# EAGLE design traffic_light (EAGLE 9.4.0)
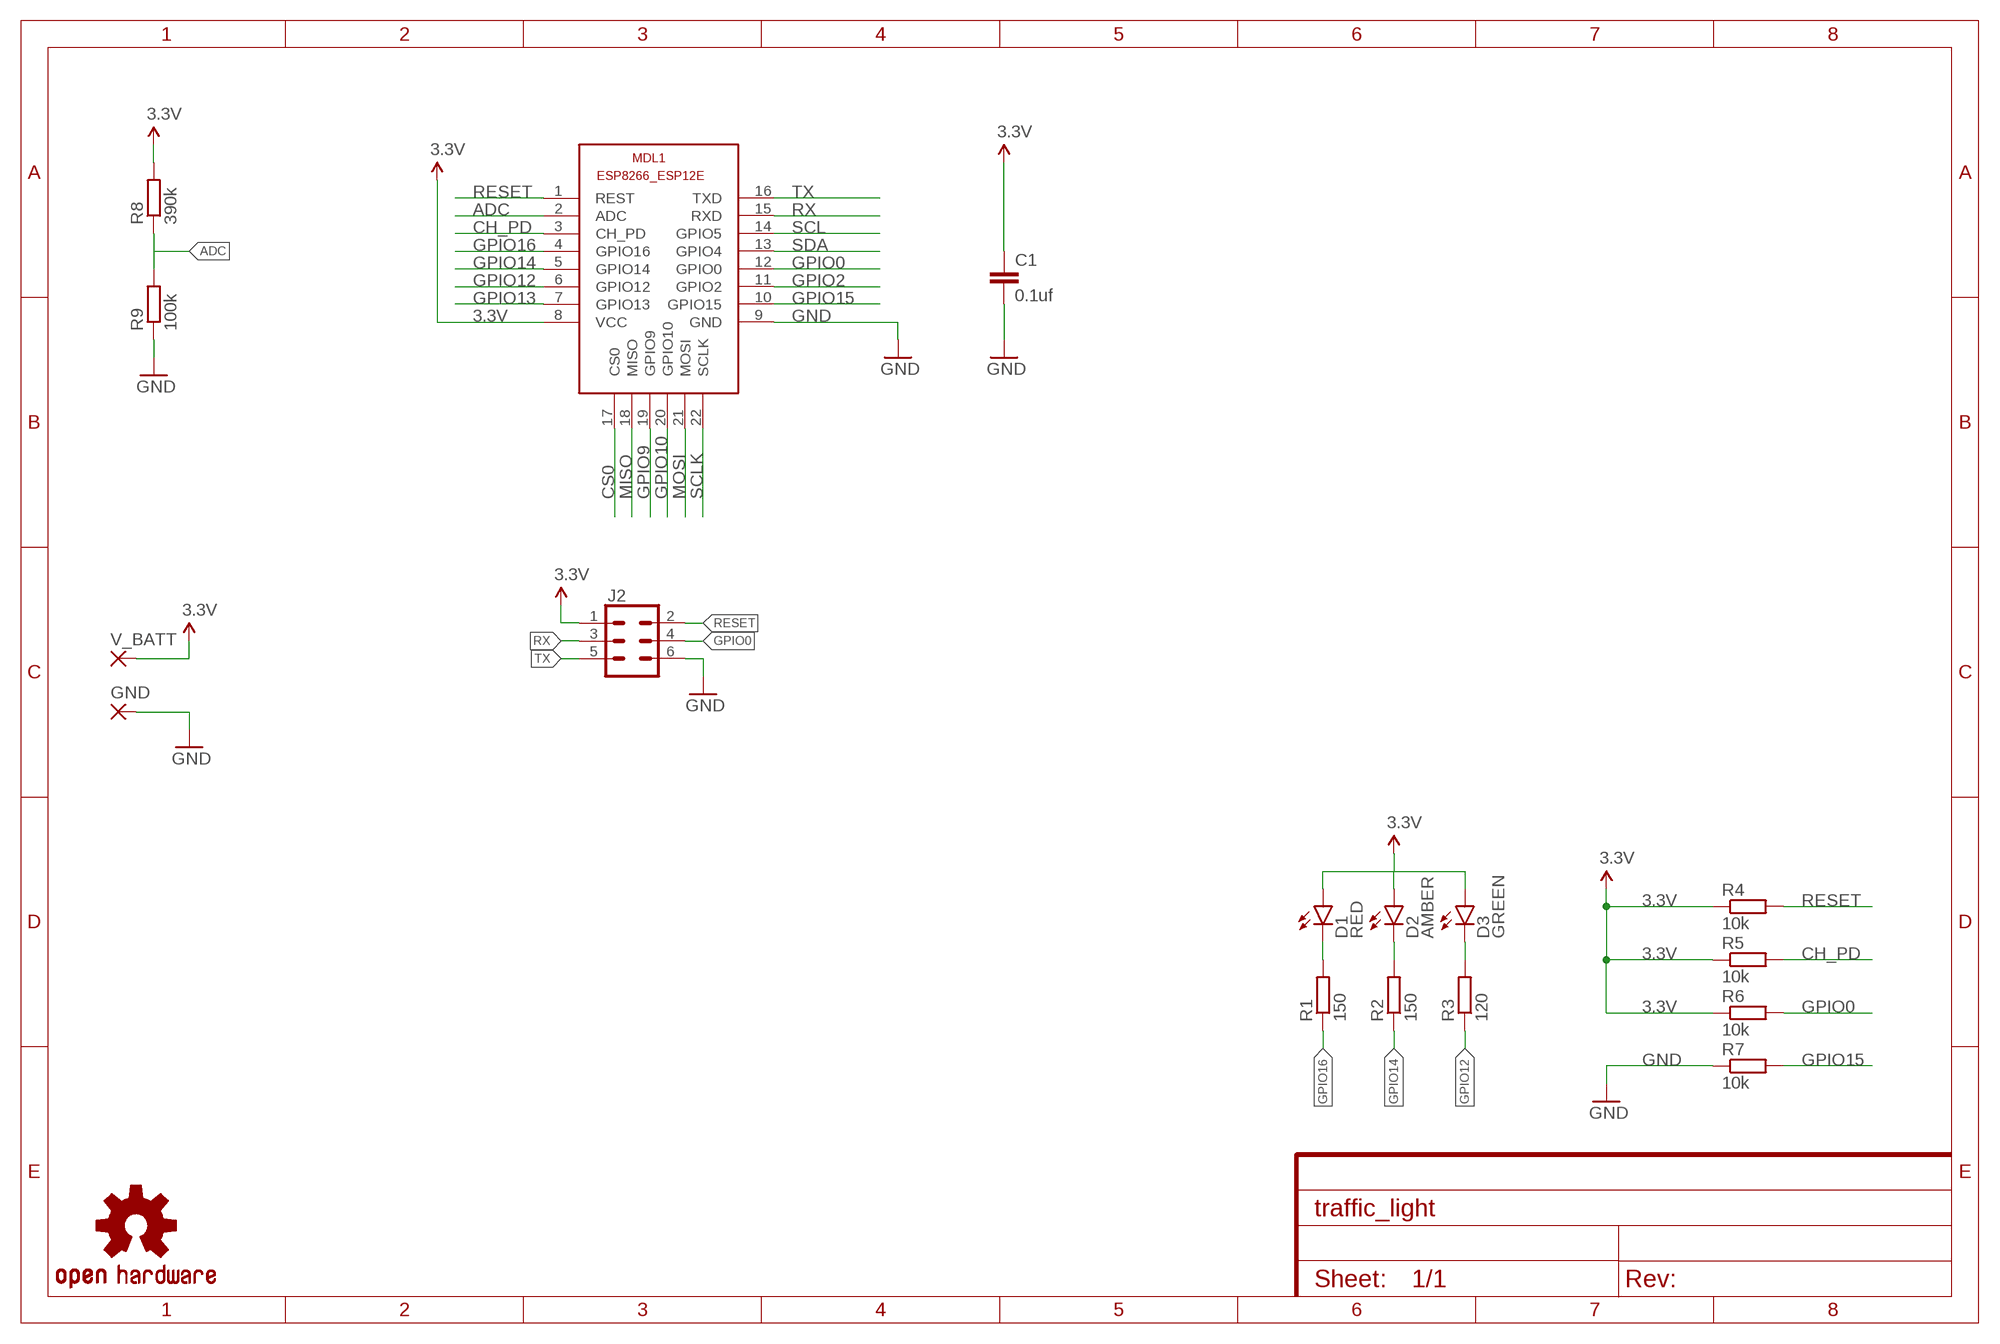
[diagram p0: schematic, sheet 1]

## Parts
C1  0.1uf  C-EUC0805  [C0805]
D1  RED  LED0603  [LED-0603]
D2  AMBER  LED0603  [LED-0603]
D3  GREEN  LED0603  [LED-0603]
GND  SMD5  [SMD2,54-5,08]
J2  CONN_03X2SHROUD  [2X3-SHROUDED]
LOGO1  OSHW-LOGOS  [OSHW-LOGO-S]
MDL1  ESP8266-12EESP8266-ESP12E  [ESP8266-ESP12E]
R1  150  R-EU_R0805  [R0805]
R2  150  R-EU_R0805  [R0805]
R3  120  R-EU_R0805  [R0805]
R4  10k  R-EU_R0805  [R0805]
R5  10k  R-EU_R0805  [R0805]
R6  10k  R-EU_R0805  [R0805]
R7  10k  R-EU_R0805  [R0805]
R8  390k  R-EU_R0805  [R0805]
R9  100k  R-EU_R0805  [R0805]
V_BATT  SMD5  [SMD2,54-5,08]

## Nets
3.3V: C1.1 D1.A D2.A D3.A J2.1 MDL1.8(VCC) R4.1 R5.1 R6.1 R8.2 V_BATT.1(P)
ADC: MDL1.2(ADC) R8.1 R9.2
CH_PD: MDL1.3(CH_PD) R5.2
CS0: MDL1.17(CS0)
GND: C1.2 GND.1(P) J2.6 MDL1.9(GND) R7.1 R9.1
GPIO0: J2.4 MDL1.12(GPIO0) R6.2
GPIO2: MDL1.11(GPIO2)
GPIO9: MDL1.19(GPIO9)
GPIO10: MDL1.20(GPIO10)
GPIO12: MDL1.6(GPIO12) R3.1
GPIO13: MDL1.7(GPIO13)
GPIO14: MDL1.5(GPIO14) R2.1
GPIO15: MDL1.10(GPIO15) R7.2
GPIO16: MDL1.4(GPIO16) R1.1
MISO: MDL1.18(MISO)
MOSI: MDL1.21(MOSI)
N$1: D1.C R1.2
N$2: D2.C R2.2
N$3: D3.C R3.2
RESET: J2.2 MDL1.1(REST) R4.2
RX: J2.3 MDL1.15(RXD)
SCL: MDL1.14(GPIO5)
SCLK: MDL1.22(SCLK)
SDA: MDL1.13(GPIO4)
TX: J2.5 MDL1.16(TXD)

## Library data of the parts
C1 = rcl:C-EU: CAPACITOR, European symbol
D1-D3 = SparkFun-LED:LED: LEDs Standard schematic elements and footprints for 5mm, 3mm, 1206, and 0603 sized LEDs. 5mm - Spark Fun Electronics SKU : COM-00529 (and others)
GND V_BATT = wirepad:SMD5: SMD PAD
J2 = SparkFun-Connectors:CONN_03X2: Multi connection point. Often used as Generic Header-pin footprint for 0.1 inch spaced/style header connections You can populate with any combo of single row headers, but if you'd like an exact match, check these: Header - 2x3 (Male, 0.1") <https://www.sparkfun.com/products/12807> (PRT-12807) Header - 2x3 (Female, 0.1") <https://www.sparkfun.com/products/13010> (PRT-13010) 2x3 Pin Shrouded Header <https://www.sparkfun.com/products/10877> (PRT-10877) On any of the 0.1 inch spaced packages, you can populate with these: Break Away Headers - Straight <https://www.sparkfun.com/products/116> (PRT-00116) Break Away Male Headers - Right Angle <https://www.sparkfun.com/products/553> (PRT-00553) Female Headers <https://www.sparkfun.com/products/115> (PRT-00115) Break Away Headers - Machine Pin <https://www.sparkfun.com/products/117> (PRT-00117) Break Away Female Headers - Swiss Machine Pin <https://www.sparkfun.com/products/743> (PRT-00743) Special note: the shrouded connector mates well with our 3x2 ribbon cables: Ribbon Crimp Connector - 6-pin (2x3, Female) <https://www.sparkfun.com/products/10651> (PRT-10651) Ribbon Cable - 6 wire (15ft) <https://www.sparkfun.com/products/10646> (PRT-10646); PROD_ID: CONN-10681; SF_ID: PRT_10877
LOGO1 = SparkFun-Aesthetics:OSHW-LOGO: Open Source Hardware Logo This logo indicates the piece of hardware it is found on incorporates a OSHW license and/or adheres to the definition of open source hardware found here: http://freedomdefined.org/OSHW
MDL1 = ESP8266-ESP12E:ESP8266-12E: ESP8266-12E with additional I/O and GPIO04/05 corrected The author cannot warrant that this library is free from error or will meet your specific requirements. Created by PuceBaboon.com. Komagane, Nagano, JAPAN
R1-R9 = rcl:R-EU_: RESISTOR, European symbol

## Board
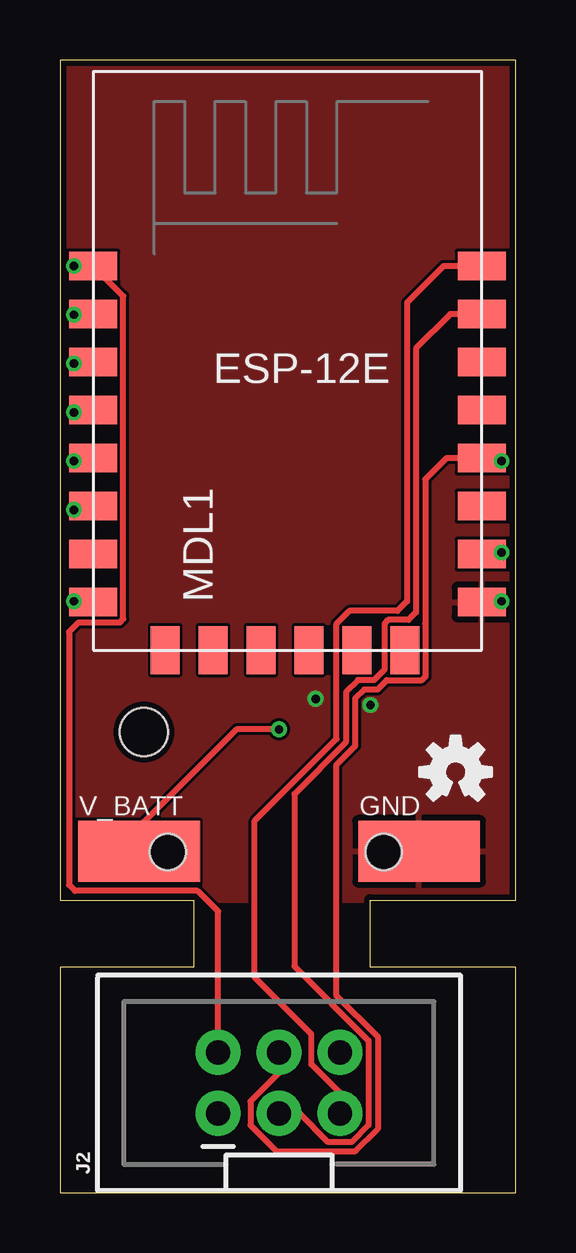
[diagram p1: board, top side]
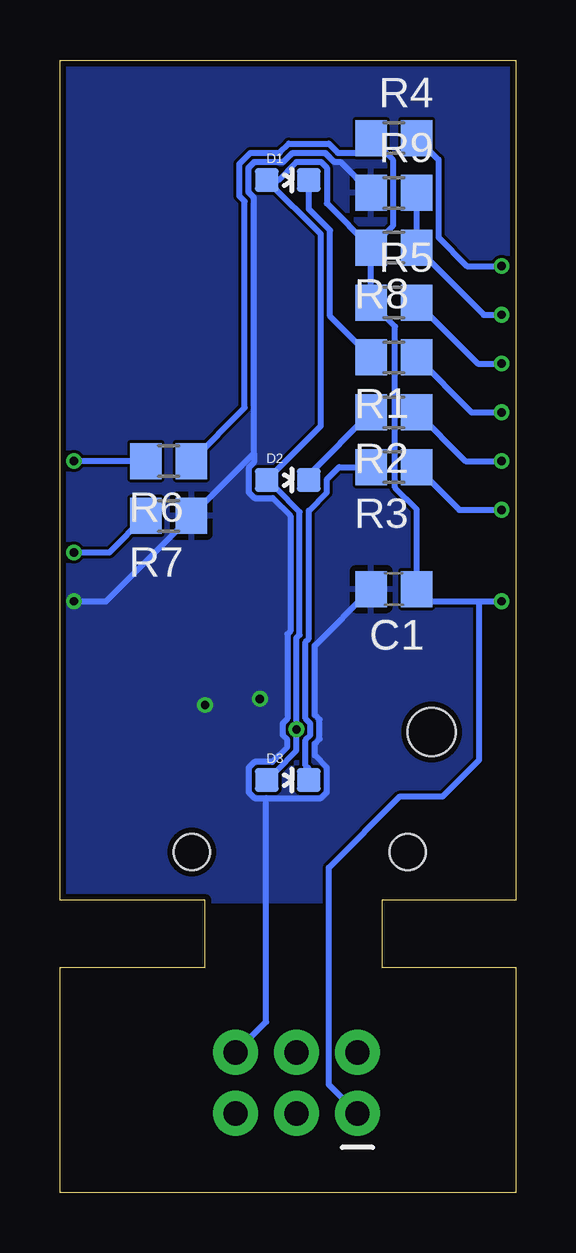
[diagram p2: board, bottom side, seen from below]

Size 19 x 47.19 mm. Coordinates in mm from the lower left corner, seen from the top.
Outline: 0,12.19 5.58,12.19 5.58,9.4 0,9.4 0,0 19,0 19,9.4 12.95,9.4 12.95,12.19 19,12.19 19,47.19 0,47.19 0,12.19
Copper layers (1*16): Top 0.035mm / dielectric 1.5mm / Bottom 0.035mm
Design rules "dirtypcbs": minimum track width 5mil, minimum drill 12mil, track to track 5mil, track to pad 5mil, pad to pad 5mil, via to via 5mil, smd to smd 0mil, copper to edge 10mil, drill to drill 10mil, minimum pad ring 10mil, minimum via ring 6mil, stop-mask expansion 2mil, vias tented up to drill 25mil, thermal gap 10mil
Holes 2 mm at 3.5,19.19
Holes 1.5 mm at 4.5,14.19 13.5,14.19

### Footprints (pad centres in the part's own frame; a part is rotated, then mirrored left to right if it is on the bottom)
C0805 = smd 1.3 x 1.5: 1 -0.95,0; 2 0.95,0
LED-0603 = smd 1 x 1: A 0,-0.877; C 0,0.877
SMD2,54-5,08 = smd 2.54 x 5.08: 1 0,0
2X3-SHROUDED = drill 1.016 pad 1.88: 1 -1.27,2.54; 2 1.27,2.54; 3 -1.27,0; 4 1.27,0; 5 -1.27,-2.54; 6 1.27,-2.54
ESP8266-ESP12E = smd 2 x 1.2: 1 0,16; 2 0,14; 3 0,12; 4 0,10; 5 0,8; 6 0,6; 7 0,4; 8 0,2; 9 16.2,2; 10 16.2,4; 11 16.2,6; 12 16.2,8; 13 16.2,10; 14 16.2,12; 15 16.2,14; 16 16.2,16 | smd 1.2 x 2: 17 11,0; 18 3,0; 19 5,0; 20 13,0; 21 7,0; 22 9,0
R0805 = smd 1.3 x 1.5: 1 -0.95,0; 2 0.95,0

### Placement (x,y rotation side)
C1  5.07,25.15 180 bottom
D1  9.5,42.19 270 bottom
D2  9.5,29.69 270 bottom
D3  9.5,17.19 270 bottom
GND  14.98,14.22 270 top
J2  9.14,4.57 90 top
LOGO1  16.5,17.53 0 top
MDL1  1.39,22.61 0 top
R1  5.07,34.8 180 bottom
R2  5.07,32.51 180 bottom
R3  5.07,30.23 180 bottom
R4  5.07,43.94 0 bottom
R5  5.07,37.08 0 bottom
R6  14.47,30.48 180 bottom
R7  14.47,28.19 180 bottom
R8  5.07,39.37 180 bottom
R9  5.07,41.66 0 bottom
V_BATT  3.29,14.22 270 top

### Tracks (layer width: path | path; a pad name or v marks a point on that pad's centre or on a via)
3.3V  (via drill 0.35)
  Top 0.254: v0.58,24.64 0.61,24.61 MDL1.8 | v9.14,19.3 7.36,19.3 3.29,15.24 V_BATT.1
  Bottom 0.254: 1.52,24.64 3.61,24.64 C1.1 4.12,28.47 5.03,29.37 5.03,36.09 R5.1 R8.2 | 1.52,24.64 v0.58,24.64 0.38,24.64 | R6.1 11.29,32.7 11.29,41.3 11.51,41.52 11.51,42.87 11.05,43.33 9.84,43.33 9.46,43.71 7.79,43.71 7.41,43.33 6.64,43.33 R4.1 5.12,43.04 5.12,40.27 R8.2 | J2.1 7.79,4.5 7.79,13.54 4.82,16.51 3.04,16.51 1.52,18.03 1.52,24.64 | D3.A 10,17.57 9.99,17.57 9.14,18.42 v9.14,19.3 9.14,23.11 9.01,23.24 9.01,28.35 9.98,29.32 10,29.32 D2.A 8.12,31.95 8.12,39.93 D1.A 9.89,42.19 9.14,42.95 8.11,42.95 7.87,42.71 7.87,41.22 R8.2
ADC  (via drill 0.35)
  Top 0.254: v0.58,36.58 1.36,36.58 MDL1.2
  Bottom 0.254: R9.2 R8.1 1.33,36.58 v0.58,36.58 0.38,36.58
CH_PD  (via drill 0.35)
  Top 0.254: v0.58,34.54 1.33,34.54 MDL1.3
  Bottom 0.254: R5.2 1.58,34.54 v0.58,34.54
GND  (via drill 0.35)
  Top 0.254: MDL1.9 17.62,24.64 v18.42,24.64
  Bottom 0.254: 10.91,30.8 R7.1 17.08,24.64 v18.42,24.64 | 10.91,30.8 10.91,41.46 11.13,41.67 11.13,42.71 10.89,42.95 9.68,42.95 9.3,43.33 7.95,43.33 7.57,42.95 7.31,42.95 R9.1 | 10.91,30.8 10.91,30.43 11.13,30.21 11.13,29.18 10.89,28.94 10.13,28.94 9.39,28.19 9.39,23.39 9.52,23.27 9.52,19.75 9.72,19.55 9.72,19.06 9.52,18.86 9.52,18.58 10.15,17.95 10.89,17.95 11.13,17.71 11.13,16.68 10.89,16.44 10.41,16.44 | C1.2 8.37,22.79 8.37,19.9 8.17,19.7 8.17,18.91 8.37,18.7 8.37,18.21 7.87,17.71 7.87,16.68 8.11,16.44 10.41,16.44 | J2.6 10.41,7.11 10.41,16.44
  other vias: 10.66,20.57 12.95,20.32
  pour Top: -1.53,50.29 21.07,50.29 21.07,12.19 -1.53,12.19
  pour Bottom: -2.17,50.93 21.71,50.93 21.71,12.19 -2.17,12.19
GPIO0  (via drill 0.35)
  Top 0.254: J2.4 9.14,4.99 7.94,3.8 7.94,2.81 9.02,1.73 12.33,1.73 13.25,2.65 13.25,6.49 11.52,8.23 11.52,17.82 12.31,18.61 12.31,20.59 12.69,20.97 13.25,20.97 13.63,21.35 15.09,21.35 15.24,21.5 15.24,23.71 15.23,23.72 15.23,29.72 16.12,30.61 MDL1.12 17.71,30.48 v18.42,30.48
  Bottom 0.254: R6.2 v18.42,30.48
GPIO12  (via drill 0.35)
  Top 0.254: v0.58,28.45 1.23,28.45 MDL1.6
  Bottom 0.254: R3.1 2.34,28.45 v0.58,28.45
GPIO14  (via drill 0.35)
  Top 0.254: v0.58,30.48 1.26,30.48 MDL1.5
  Bottom 0.254: R2.1 2.09,30.48 v0.58,30.48
GPIO15  (via drill 0.35)
  Top 0.254: v18.42,26.67 17.65,26.67 MDL1.10
  Bottom 0.254: R7.2 16.94,26.67 v18.42,26.67
GPIO16  (via drill 0.35)
  Top 0.254: v0.58,32.51 1.29,32.51 MDL1.4
  Bottom 0.254: R1.1 1.84,32.51 v0.58,32.51
N$1
  Bottom 0.254: R1.2 7.74,36.51 7.74,40.09 8.62,40.98 D1.C
N$2
  Bottom 0.254: R2.2 8.62,29.91 D2.C
N$3
  Bottom 0.254: R3.2 7.36,30.23 7.87,29.71 7.87,29.18 8.62,28.42 8.62,23.08 8.76,22.95 8.76,19.75 8.55,19.55 8.55,19.06 8.76,18.86 8.76,17.79 8.62,17.66 D3.C
RESET  (via drill 0.35)
  Top 0.254: v0.58,38.61 MDL1.1 2.64,37.35 2.64,23.9 2.49,23.75 0.77,23.75 0.38,23.37 0.38,12.82 0.63,12.57 5.74,12.57 6.6,11.71 J2.2
  Bottom 0.254: R4.2 3.22,43.04 3.22,39.8 2.02,38.61 v0.58,38.61
RX
  Top 0.254: J2.3 9.99,3.3 11.18,2.11 12.17,2.11 12.87,2.81 12.87,6.34 9.77,9.44 9.77,16.61 11.92,18.75 11.92,18.78 11.93,18.8 11.93,20.86 12.42,21.35 13.09,21.35 13.54,21.79 13.54,23.71 13.68,23.86 14.54,23.86 14.85,24.18 14.85,35.18 16.28,36.61 MDL1.15
TX
  Top 0.254: J2.5 11.68,4.15 10.48,5.35 10.48,6.6 8.12,8.97 8.12,15.49 11.54,18.91 11.54,23.71 12.06,24.24 14.07,24.24 14.47,24.64 14.47,37.08 15.99,38.61 16,38.61 MDL1.16